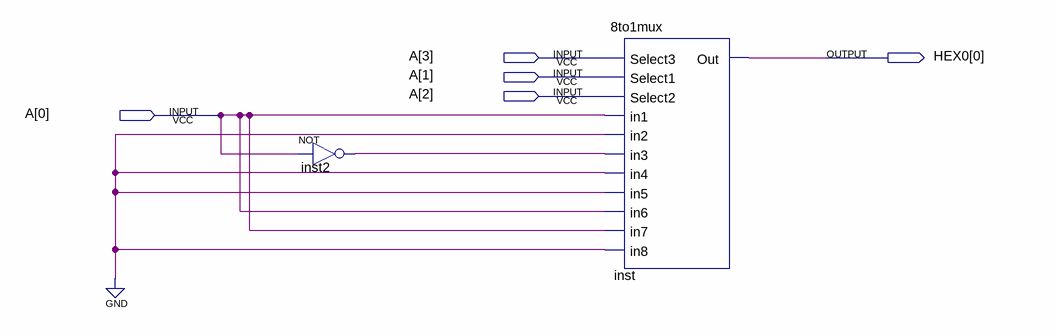
[diagram p0: schematic sheet]
// Quartus schematic seg0.bdf as structural Verilog: 2 symbols, 5 pins
module seg0 (
  input  [3:0] A,
  output [0:0] HEX0
);

  wire inst2_out;

  not inst2 (inst2_out, A[0]);
  \8to1mux  inst (
    .Select3(A[3]), .Select1(A[1]), .Select2(A[2]), .in1(A[0]), .in2(1'b0), .in3(inst2_out), .in4(1'b0),
    .in5(1'b0), .in6(A[0]), .in7(A[0]), .in8(1'b0), .Out(HEX0[0]));
endmodule
